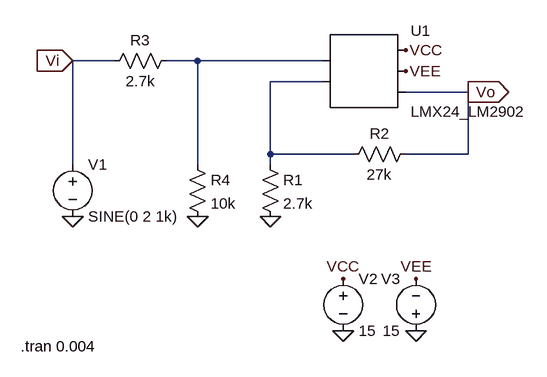
[diagram p0: schematic ej1_2.asc]
ej1_2.asc, the LTspice schematic file:
Version 4
SHEET 1 880 680
WIRE -176 128 -240 128
WIRE -48 128 -96 128
WIRE 144 128 -48 128
WIRE 144 160 64 160
WIRE 368 176 272 176
WIRE 64 272 64 160
WIRE 192 272 64 272
WIRE 368 272 368 176
WIRE 368 272 272 272
WIRE -240 288 -240 128
WIRE -48 288 -48 128
WIRE 64 288 64 272
FLAG -240 368 0
FLAG -48 368 0
FLAG 64 368 0
FLAG 176 544 0
FLAG 288 544 0
FLAG 176 464 VCC
FLAG 272 112 VCC
FLAG 288 464 VEE
FLAG 272 144 VEE
FLAG 368 176 Vo
IOPIN 368 176 Out
FLAG -240 128 Vi
IOPIN -240 128 In
SYMBOL AutoGenerated\\LMX24_LM2902 208 144 R0
SYMATTR InstName U1
SYMBOL res 48 272 R0
SYMATTR InstName R1
SYMATTR Value 2.7k
SYMBOL res 288 256 R90
WINDOW 0 0 56 VBottom 2
WINDOW 3 32 56 VTop 2
SYMATTR InstName R2
SYMATTR Value 27k
SYMBOL res -80 112 R90
WINDOW 0 0 56 VBottom 2
WINDOW 3 32 56 VTop 2
SYMATTR InstName R3
SYMATTR Value 2.7k
SYMBOL res -64 272 R0
SYMATTR InstName R4
SYMATTR Value 10k
SYMBOL voltage -240 272 R0
WINDOW 123 0 0 Left 2
WINDOW 39 0 0 Left 2
SYMATTR InstName V1
SYMATTR Value SINE(0 2 1k)
SYMBOL voltage 176 448 R0
WINDOW 123 0 0 Left 2
WINDOW 39 0 0 Left 2
SYMATTR InstName V2
SYMATTR Value 15
SYMBOL voltage 288 560 R180
WINDOW 0 24 96 Left 2
WINDOW 3 24 16 Left 2
WINDOW 123 0 0 Left 2
WINDOW 39 0 0 Left 2
SYMATTR InstName V3
SYMATTR Value 15
TEXT -320 568 Left 2 !.tran 0.004

The netlist it stands for:
* ej1_2.asc
* U1: LMX24_LM2902 (symbol AutoGenerated\LMX24_LM2902 not available, pins judged from their places): pin1=N001 pin2=N002 pin3=VCC pin4=VEE pin5=Vo
R1 N002 0 2.7k
R2 Vo N002 27k
R3 N001 Vi 2.7k
R4 N001 0 10k
V1 Vi 0 SINE(0 2 1k)
V2 VCC 0 15
V3 0 VEE 15
.tran 0.004
.backanno
.end